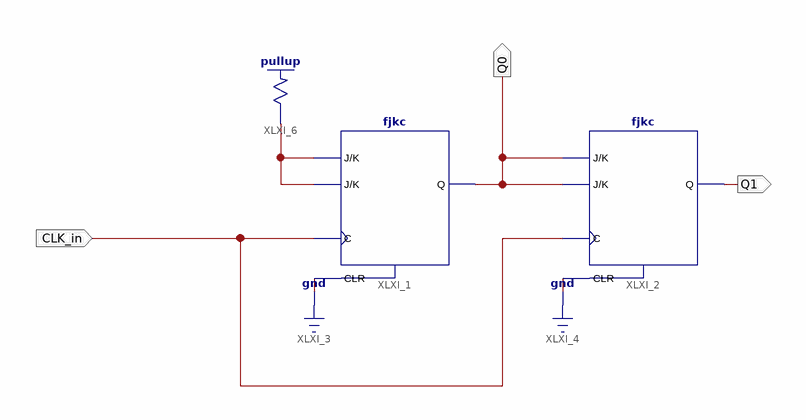
[diagram p0: schematic sheet 1]
// Xilinx ISE schematic modFour_stateCounter.sch (spartan3e) as structural Verilog: 3 symbols, 3 ports
module modFour_stateCounter (
  input  CLK_in,
  output Q0,
  output Q1
);

  wire XLXN_12;

  fjkc XLXI_1 (.C(CLK_in), .CLR(1'b0), .J(XLXN_12), .K(XLXN_12), .Q(Q0));
  fjkc XLXI_2 (.C(CLK_in), .CLR(1'b0), .J(Q0), .K(Q0), .Q(Q1));
  \pullup  XLXI_6 (.O(XLXN_12));
endmodule
